# EAGLE schematic Carte Asservissement (EAGLE 9.5.0)
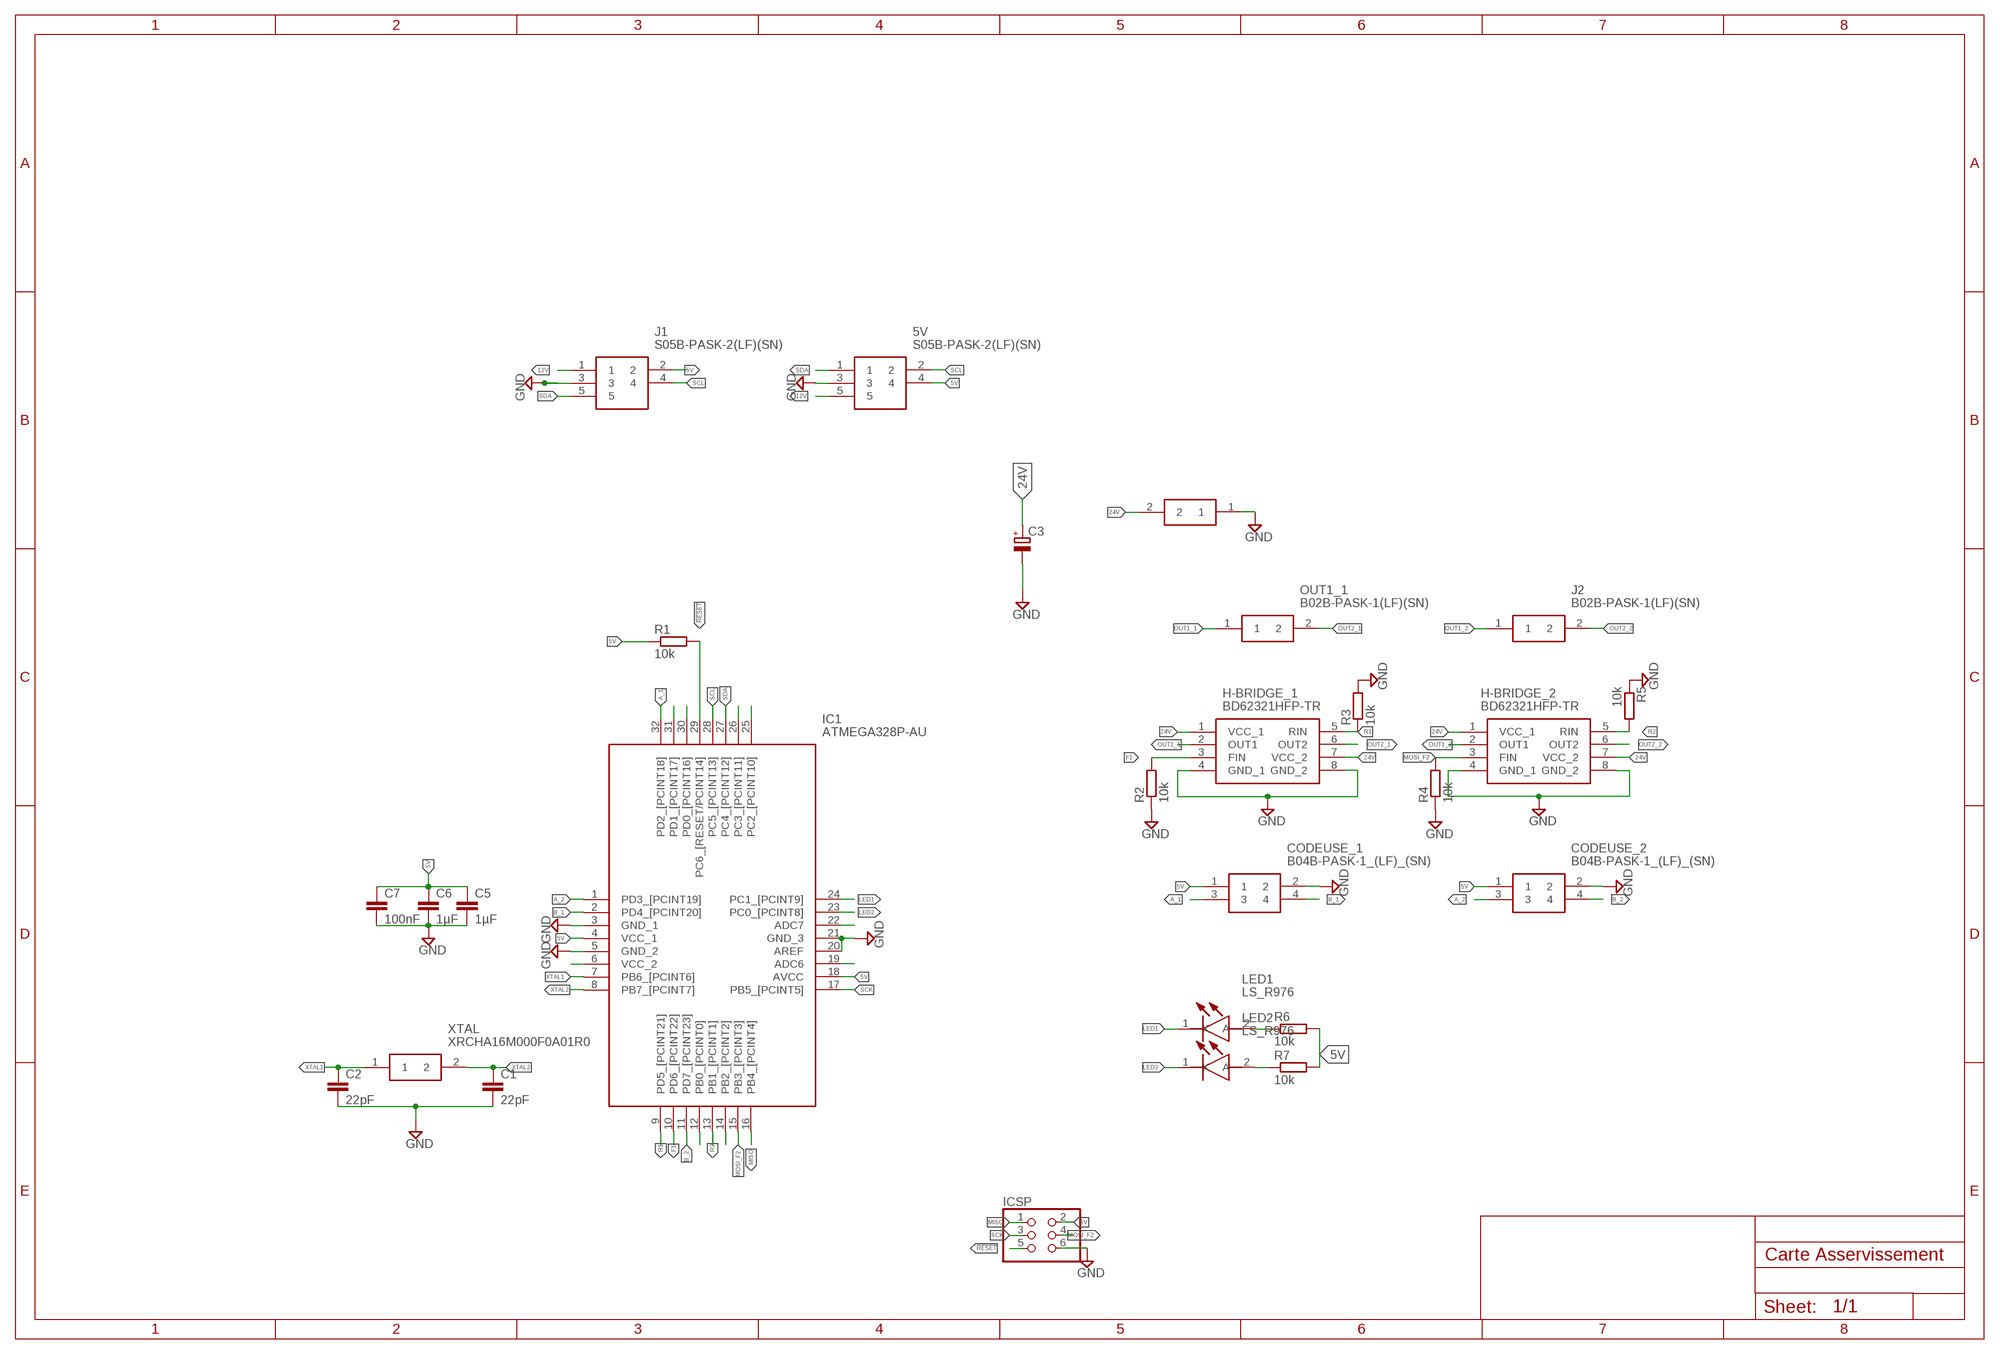
[diagram p0: schematic, sheet 1]

## Parts
5V  S05B-PASK-2(LF)(SN)  [S05B-PASK-2(LF)(SN)]
C1  22pF  C-EUC0805  [C0805]
C2  22pF  C-EUC0805  [C0805]
C3  CPOL-EUSANYO_SMD_C6  [SANYO-OSCON_SMD_C6]
C5  1µF  C-EUC0805  [C0805]
C6  1µF  C-EUC0805  [C0805]
C7  100nF  C-EUC0805  [C0805]
CODEUSE_1  B04B-PASK-1_(LF)_(SN)  [B04B-PASK-1]
CODEUSE_2  B04B-PASK-1_(LF)_(SN)  [B04B-PASK-1]
H-BRIDGE_1  BD62321HFP-TR  [HRP7]
H-BRIDGE_2  BD62321HFP-TR  [HRP7]
IC1  ATMEGA328P-AU  [QFP80P900X900X120-32N]
ICSP  PINHD-2X3  [2X03]
J1  S05B-PASK-2(LF)(SN)  [S05B-PASK-2(LF)(SN)]
J2  B02B-PASK-1(LF)(SN)  [B02BPASK1LFSN]
LED1  LS_R976  [LEDC2012X40N]
LED2  LS_R976  [LEDC2012X40N]
OUT1_1  B02B-PASK-1(LF)(SN)  [B02BPASK1LFSN]
OUT1_2  B02B-PASK-1(LF)(SN)  [B02BPASK1LFSN]
R1  10k  R-EU_R0805  [R0805]
R2  10k  R-EU_R0805  [R0805]
R3  10k  R-EU_R0805  [R0805]
R4  10k  R-EU_R0805  [R0805]
R5  10k  R-EU_R0805  [R0805]
R6  10k  R-EU_R0805  [R0805]
R7  10k  R-EU_R0805  [R0805]
XTAL  XRCHA16M000F0A01R0  [XRCHA]

## Nets
5V: 5V.4 C5.1 C6.1 C7.1 CODEUSE_1.1 CODEUSE_2.1 IC1.4(VCC_1) IC1.18(AVCC) ICSP.2 J1.2 R1.1 R6.2 R7.2
12V: 5V.5 J1.1
24V: C3.+ H-BRIDGE_1.1(VCC_1) H-BRIDGE_1.7(VCC_2) H-BRIDGE_2.1(VCC_1) H-BRIDGE_2.7(VCC_2) OUT1_2.2
!RESET: IC1.29(PC6_[RESET/PCINT14]) ICSP.5 R1.2
A_1: CODEUSE_1.3 IC1.32(PD2_[PCINT18])
A_2: CODEUSE_2.3 IC1.1(PD3_[PCINT19])
B_1: CODEUSE_1.4 IC1.2(PD4_[PCINT20])
B_2: CODEUSE_2.4 IC1.11(PD7_[PCINT23])
F1: H-BRIDGE_1.3(FIN) IC1.10(PD6_[PCINT22]) R2.2
GND: 5V.3 C1.2 C2.2 C3.- C5.2 C6.2 C7.2 CODEUSE_1.2 CODEUSE_2.2 H-BRIDGE_1.4(GND_1) H-BRIDGE_1.8(GND_2) H-BRIDGE_2.4(GND_1) H-BRIDGE_2.8(GND_2) IC1.3(GND_1) IC1.5(GND_2) IC1.20(AREF) IC1.21(GND_3) ICSP.6 J1.3 OUT1_2.1 R2.1 R3.2 R4.1 R5.1
LED1: IC1.24(PC1_[PCINT9]) LED1.1(K)
LED2: IC1.23(PC0_[PCINT8]) LED2.1(K)
MISO: IC1.16(PB4_[PCINT4]) ICSP.1
MOSI_F2: H-BRIDGE_2.3(FIN) IC1.15(PB3_[PCINT3]) ICSP.4 R4.2
N$3: LED1.2(A) R6.1
N$4: LED2.2(A) R7.1
N$5: IC1.22(ADC7)
N$6: IC1.19(ADC6)
N$9: IC1.31(PD1_[PCINT17])
N$11: IC1.12(PB0_[PCINT0])
N$12: IC1.6(VCC_2)
N$13: IC1.14(PB2_[PCINT2])
N$14: IC1.30(PD0_[PCINT16])
N$22: IC1.25(PC2_[PCINT10])
N$23: IC1.26(PC3_[PCINT11])
OUT1_1: H-BRIDGE_1.2(OUT1) OUT1_1.1
OUT1_2: H-BRIDGE_2.2(OUT1) J2.1
OUT2_1: H-BRIDGE_1.6(OUT2) OUT1_1.2
OUT2_2: H-BRIDGE_2.6(OUT2) J2.2
R1: H-BRIDGE_1.5(RIN) IC1.9(PD5_[PCINT21]) R3.1
R2: H-BRIDGE_2.5(RIN) IC1.13(PB1_[PCINT1]) R5.2
SCK: IC1.17(PB5_[PCINT5]) ICSP.3
SCL: 5V.2 IC1.28(PC5_[PCINT13]) J1.4
SDA: 5V.1 IC1.27(PC4_[PCINT12]) J1.5
XTAL1: C2.1 IC1.7(PB6_[PCINT6]) XTAL.1
XTAL2: C1.1 IC1.8(PB7_[PCINT7]) XTAL.2

## Library data of the parts
5V J1 = SamacSys_Parts:S05B-PASK-2(LF)(SN): CONN HEADER PA 5POS SIDE 2MM TIN Source: Datasheet <http://www.jst-mfg.com/product/pdf/eng/ePA-F.pdf>; DESCRIPTION: CONN HEADER PA 5POS SIDE 2MM TIN; HEIGHT: mm; MANUFACTURER_NAME: JST (JAPAN SOLDERLESS TERMINALS); MANUFACTURER_PART_NUMBER: S05B-PASK-2(LF)(SN)
C1 C2 C5-C7 = rcl:C-EU: CAPACITOR, European symbol; SPICEPREFIX: C
C3 = rcl:CPOL-EU: POLARIZED CAPACITOR, European symbol; SPICEPREFIX: C
CODEUSE_1 CODEUSE_2 = SamacSys_Parts:B04B-PASK-1_(LF)_(SN): JST Polyamide Series, 2mm Pitch 4 Way 1 Row Straight PCB Header, Solder Termination, 3A Source: Datasheet <http://www.jst-mfg.com/product/pdf/eng/ePA-F.pdf>; DESCRIPTION: JST Polyamide Series, 2mm Pitch 4 Way 1 Row Straight PCB Header, Solder Termination, 3A; HEIGHT: mm; MANUFACTURER_NAME: JST (JAPAN SOLDERLESS TERMINALS); MANUFACTURER_PART_NUMBER: B04B-PASK-1 (LF) (SN); RS_PART_NUMBER: 5128608P; RS_PRICE-STOCK: http://uk.rs-online.com/web/p/products/5128608P
H-BRIDGE_1 H-BRIDGE_2 = SamacSys_Parts:BD62321HFP-TR: H-Bridge motor driver,36V,3A,HRP7 ROHM BD62321HFP-TR Full Bridge Motor Driver 3A, 7-Pin HRP7 Source: Datasheet <http://rohmfs.rohm.com/en/products/databook/datasheet/ic/motor/dc/bd62321hfp-e.pdf>; DESCRIPTION: H-Bridge motor driver,36V,3A,HRP7 ROHM BD62321HFP-TR Full Bridge Motor Driver 3A, 7-Pin HRP7; HEIGHT: mm; MANUFACTURER_NAME: ROHM Semiconductor; MANUFACTURER_PART_NUMBER: BD62321HFP-TR; MOUSER_PART_NUMBER: 755-BD62321HFP-TR; MOUSER_PRICE-STOCK: https://www.mouser.com/Search/Refine.aspx?Keyword=755-BD62321HFP-TR; RS_PART_NUMBER: 1246483P; RS_PRICE-STOCK: http://uk.rs-online.com/web/p/products/1246483P
IC1 = SamacSys_Parts:ATMEGA328P-AU: MICROCHIP - ATMEGA328P-AU. - MICROCONTROLLER MCU, 8 BIT, ATMEGA, 20MHZ, TQFP-32 Source: Datasheet <https://componentsearchengine.com/Datasheets/2/ATMEGA328P-AU.pdf>; DESCRIPTION: MICROCHIP - ATMEGA328P-AU. - MICROCONTROLLER MCU, 8 BIT, ATMEGA, 20MHZ, TQFP-32; HEIGHT: 1.2mm; MANUFACTURER_NAME: Microchip; MANUFACTURER_PART_NUMBER: ATMEGA328P-AU; MOUSER_PART_NUMBER: 556-ATMEGA328P-AU; MOUSER_PRICE-STOCK: https://www.mouser.com/Search/Refine.aspx?Keyword=556-ATMEGA328P-AU; RS_PART_NUMBER: 1310271P; RS_PRICE-STOCK: http://uk.rs-online.com/web/p/products/1310271P
ICSP = pinhead:PINHD-2X3: PIN HEADER
J2 OUT1_1 OUT1_2 = SamacSys_Parts:B02B-PASK-1(LF)(SN): CONN HEADER VERT 2POS 2MM Source: Datasheet <http://www.jst-mfg.com/product/pdf/eng/ePA-F.pdf>; DESCRIPTION: CONN HEADER VERT 2POS 2MM; HEIGHT: 7.7mm; MANUFACTURER_NAME: JST (JAPAN SOLDERLESS TERMINALS); MANUFACTURER_PART_NUMBER: B02B-PASK-1(LF)(SN)
LED1 LED2 = SamacSys_Parts:LS_R976: Red 0805 CHIPLED LS R976N-R102 Osram Opto LS R976, CHIPLED 0805 Series Red LED, 633 nm, 2012 (0805), Rectangle Lens SMD Package Source: Datasheet <http://uk.rs-online.com/web/p/products/4974804>; DESCRIPTION: Red 0805 CHIPLED LS R976N-R102 Osram Opto LS R976, CHIPLED 0805 Series Red LED, 633 nm, 2012 (0805), Rectangle Lens SMD Package; HEIGHT: 0.4mm; MANUFACTURER_NAME: OSRAM Opto Semiconductors; MANUFACTURER_PART_NUMBER: LS R976; MOUSER_PART_NUMBER: 720-LSR976-NR-1; MOUSER_PRICE-STOCK: https://www.mouser.com/Search/Refine.aspx?Keyword=720-LSR976-NR-1; RS_PART_NUMBER: 4974804P; RS_PRICE-STOCK: http://uk.rs-online.com/web/p/products/4974804P
R1-R7 = rcl:R-EU_: RESISTOR, European symbol; SPICEPREFIX: R
XTAL = SamacSys_Parts:XRCHA16M000F0A01R0: Crystal Unit for Automotive, 16.0000 MHz, 100 ESR, 8pF Source: Datasheet <http://www.murata.com/~/media/webrenewal/products/timingdevice/crystalu/flyers/vppt-hcrj078-d.ashx?la=en-us>; DESCRIPTION: Crystal Unit for Automotive, 16.0000 MHz, 100 ESR, 8pF; HEIGHT: mm; MANUFACTURER_NAME: Murata Electronics; MANUFACTURER_PART_NUMBER: XRCHA16M000F0A01R0; MOUSER_PART_NUMBER: 81-XRCHA16M000F0A1R0; MOUSER_PRICE-STOCK: https://www.mouser.com/Search/Refine.aspx?Keyword=81-XRCHA16M000F0A1R0; RS_PART_NUMBER: 1446622; RS_PRICE-STOCK: http://uk.rs-online.com/web/p/products/1446622